# EasyEDA schematic SCH_PieV2.json
TITLE: Sheet_1; REV: 1.0; Date: 2024-03-05; Sheet: 1/1; Drawn By: revaga; Company: Your Company
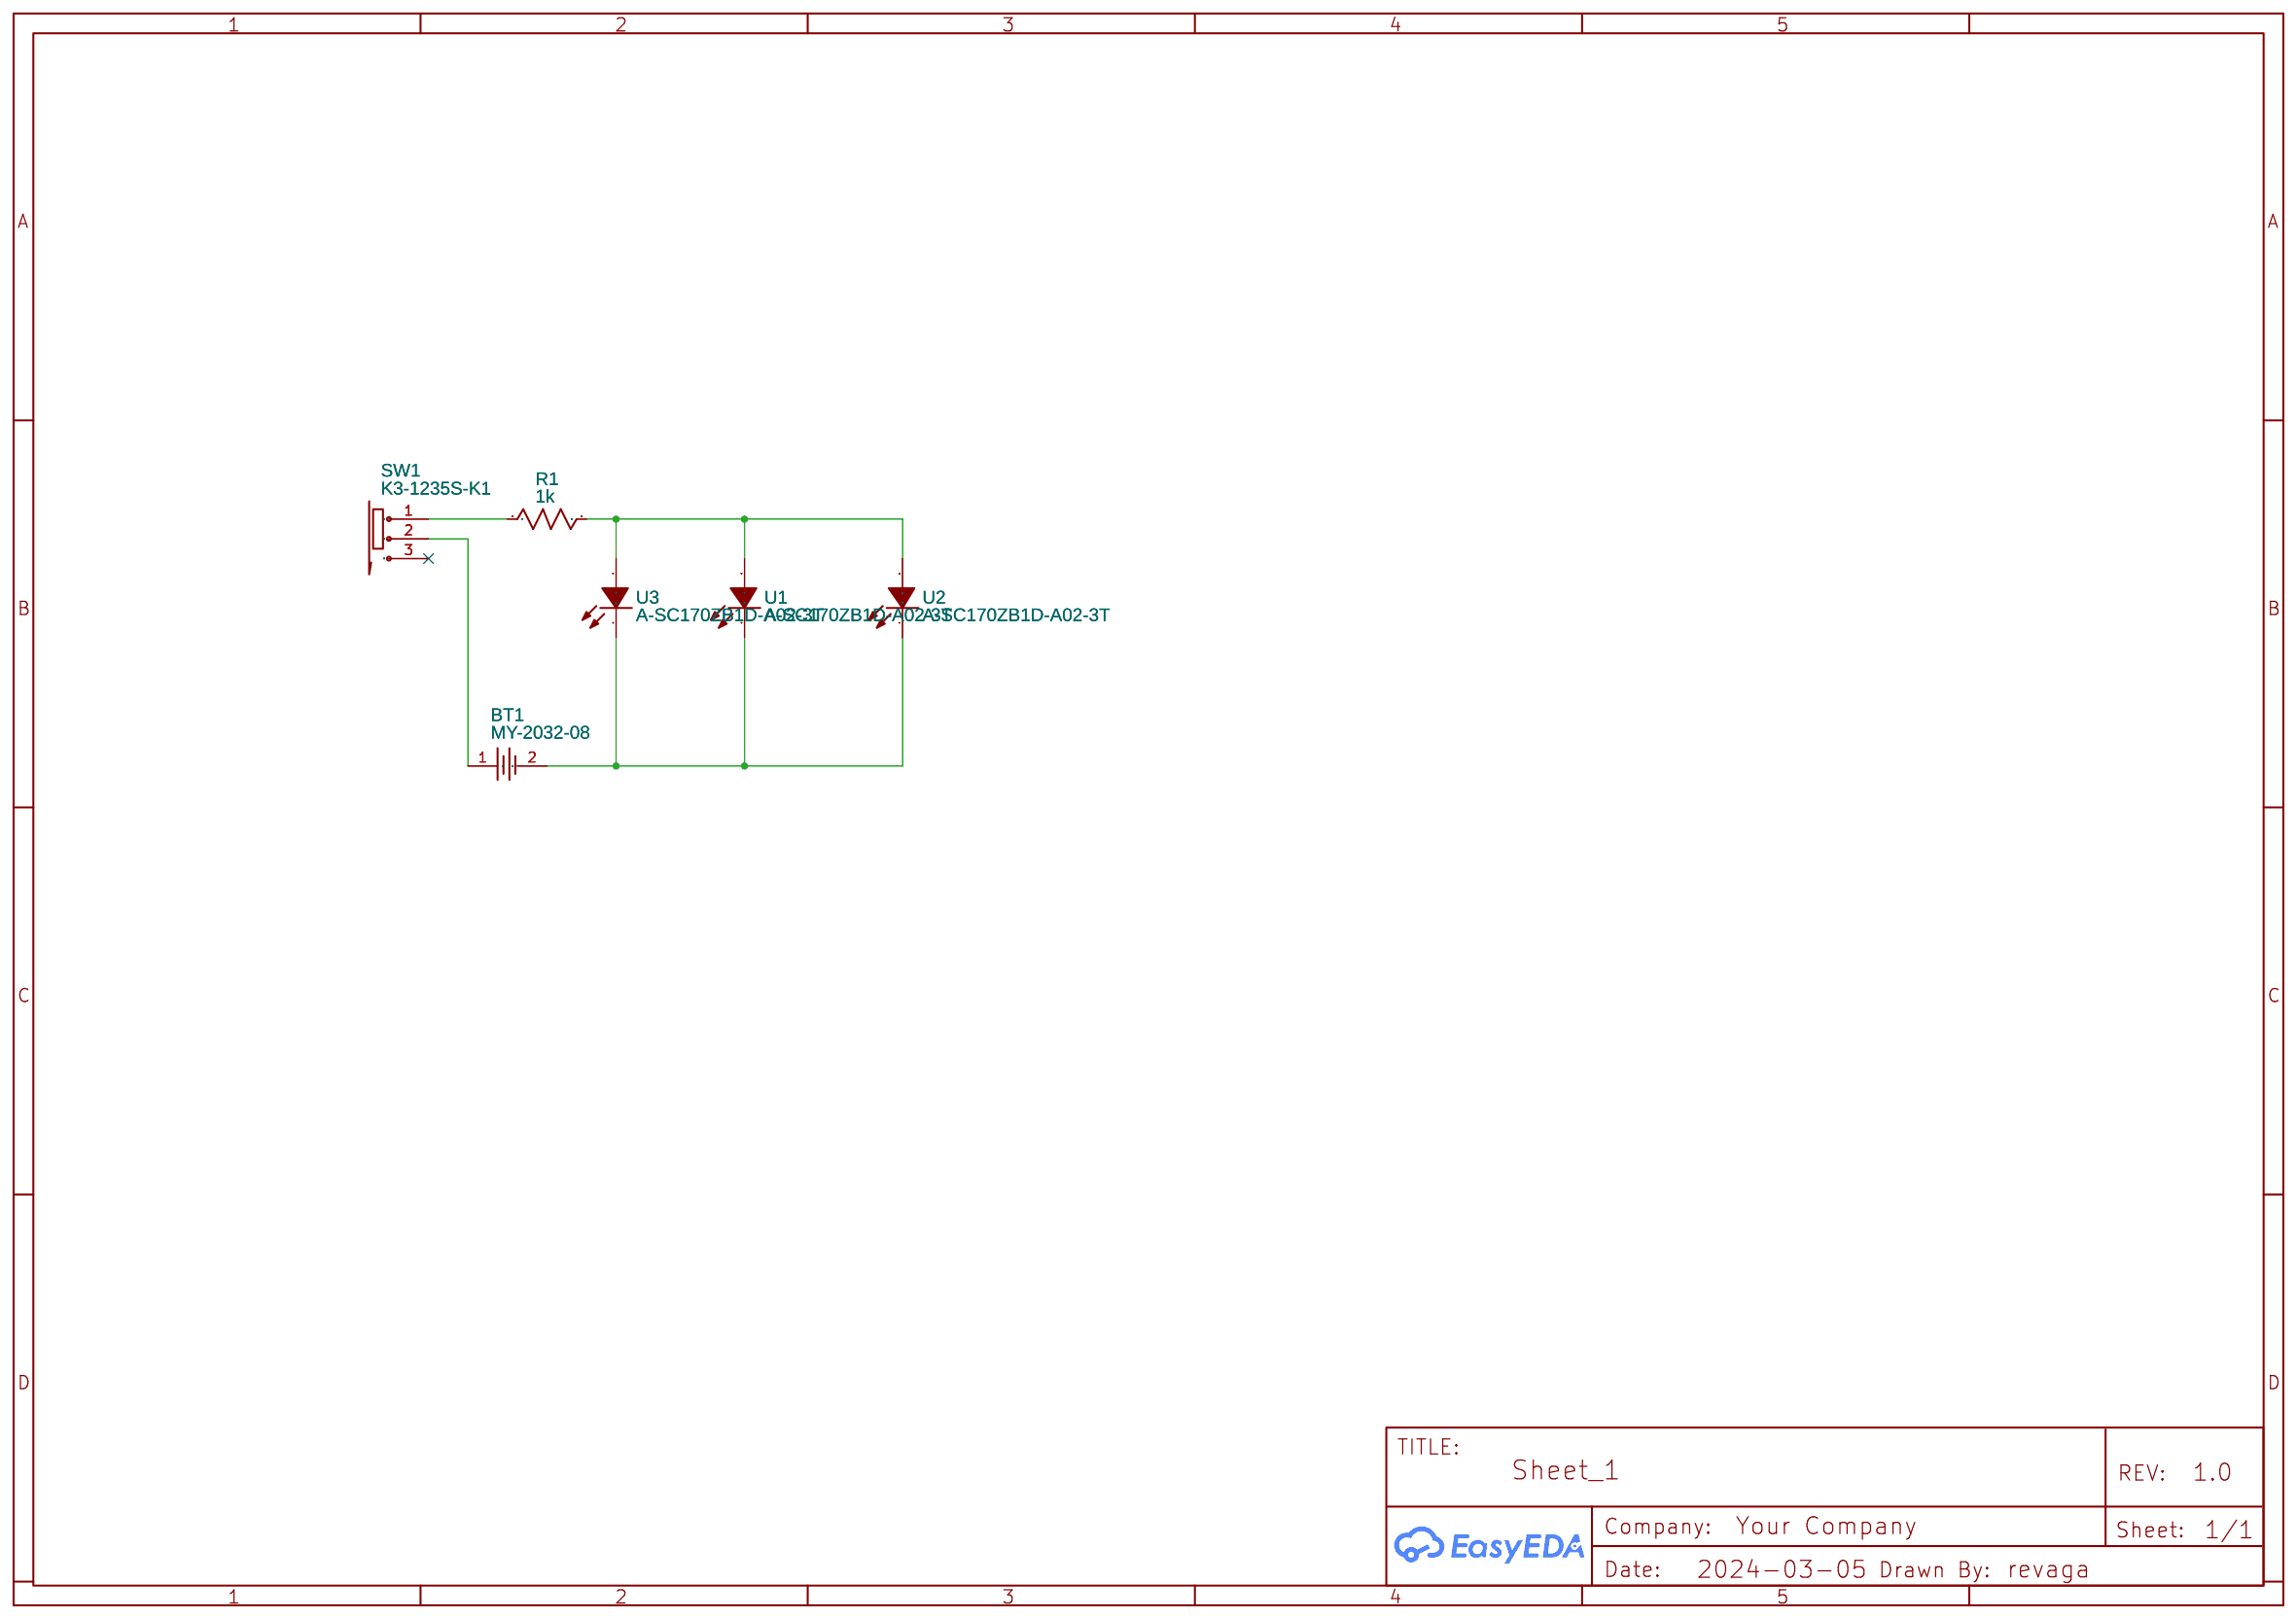
[diagram p0: schematic sheet]

## Parts
BT1  MY-2032-08  [BAT-SMD_MY-2032-08]
R1  1k  [R0402]
SW1  K3-1235S-K1  [SW-SMD_K3-1235S-K1]
U1  A-SC170ZB1D-A02-3T  [LED0805-RD]
U2  A-SC170ZB1D-A02-3T  [LED0805-RD]
U3  A-SC170ZB1D-A02-3T  [LED0805-RD]

## Library data of the parts
BT1 = MY-2032-08: Contributor: LCSC; Supplier: LCSC; Supplier Part: C964831; Manufacturer: MYOUNG(美阳); JLCPCB Part Class: Extended Part
R1 = R_0402_US: Contributor: LCEDA_Lib
SW1 = K3-1235S-K1: Contributor: LCSC; Supplier: LCSC; Supplier Part: C223837; Manufacturer: 韩国韩荣; JLCPCB Part Class: Extended Part
U1-U3 = A-SC170ZB1D-A02-3T: Contributor: lcsc; Supplier: LCSC; Supplier Part: C5355441; Manufacturer: Amicc(欧密格光电)

## Nets
Net-(BT1-1): BT1.1 SW1.2
Net-(BT1-2): BT1.2 U1.1(C) U2.1(C) U3.1(C)
Net-(R1-1): R1.1 SW1.1
Net-(R1-2): R1.2 U1.2(A) U2.2(A) U3.2(A)

Not connected (* = marked no-connect by the designer): SW1 3*
